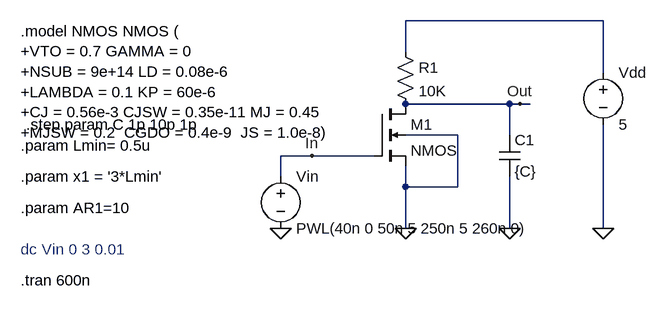
[diagram p0: schematic nmos.asc]
nmos.asc, the LTspice schematic file:
Version 4
SHEET 1 880 680
WIRE 704 160 400 160
WIRE 400 208 400 160
WIRE 704 240 704 160
WIRE 560 288 400 288
WIRE 576 288 560 288
WIRE 592 288 576 288
WIRE 480 336 400 336
WIRE 560 336 560 288
WIRE 256 368 208 368
WIRE 352 368 256 368
WIRE 208 400 208 368
WIRE 400 416 400 384
WIRE 480 416 480 336
WIRE 480 416 400 416
WIRE 400 480 400 416
WIRE 560 480 560 400
WIRE 704 480 704 320
FLAG 400 480 0
FLAG 208 480 0
FLAG 560 480 0
FLAG 704 480 0
FLAG 576 288 Out
FLAG 256 368 In
SYMBOL nmos4 352 288 R0
SYMATTR InstName M1
SYMBOL Voltage 704 224 R0
SYMATTR InstName Vdd
SYMATTR Value 5
SYMBOL Voltage 208 384 R0
SYMATTR InstName Vin
SYMATTR Value PWL(40n 0 50n 5 250n 5 260n 0)
SYMBOL Cap 544 336 R0
SYMATTR InstName C1
SYMATTR Value {C}
SYMBOL Res 384 192 R0
SYMATTR InstName R1
SYMATTR Value 10K
TEXT -192 176 Left 2 !.model NMOS NMOS ( \n+VTO = 0.7 GAMMA = 0 \n+NSUB = 9e+14 LD = 0.08e-6 \n+LAMBDA = 0.1 KP = 60e-6 \n+CJ = 0.56e-3 CJSW = 0.35e-11 MJ = 0.45 \n+MJSW = 0.2  CGDO = 0.4e-9  JS = 1.0e-8)
TEXT -192 352 Left 2 !.param Lmin= 0.5u
TEXT -192 400 Left 2 !.param x1 = '3*Lmin'
TEXT -192 448 Left 2 !.param AR1=10
TEXT -192 512 Left 2 ;dc Vin 0 3 0.01
TEXT -184 320 Left 2 !.step param C 1p 10p 1p
TEXT -192 560 Left 2 !.tran 600n

The netlist it stands for:
* nmos.asc
M1 Out In 0 0 NMOS
Vdd N001 0 5
Vin In 0 PWL(40n 0 50n 5 250n 5 260n 0)
C1 Out 0 {C}
R1 N001 Out 10K
.model NMOS NMOS
.model PMOS PMOS
.lib standard.mos
.model NMOS NMOS (
+VTO = 0.7 GAMMA = 0
+NSUB = 9e+14 LD = 0.08e-6
+LAMBDA = 0.1 KP = 60e-6
+CJ = 0.56e-3 CJSW = 0.35e-11 MJ = 0.45
+MJSW = 0.2  CGDO = 0.4e-9  JS = 1.0e-8)
.param Lmin= 0.5u
.param x1 = '3*Lmin'
.param AR1=10
* dc Vin 0 3 0.01
.step param C 1p 10p 1p
.tran 600n
.backanno
.end